# Altium schematic sheet XT short bus with break-away tab ( 5.2 X 4.2 inches).schdoc: XT short bus with break-away tab ( 5.2 X 4.2 inches)
size A2; Organization: Organization; Address1: Address1; Address2: Address2; Address3: Address3; Address4: Address4; DocumentNumber: 1; Revision: 0; SheetNumber: 2; SheetTotal: 2
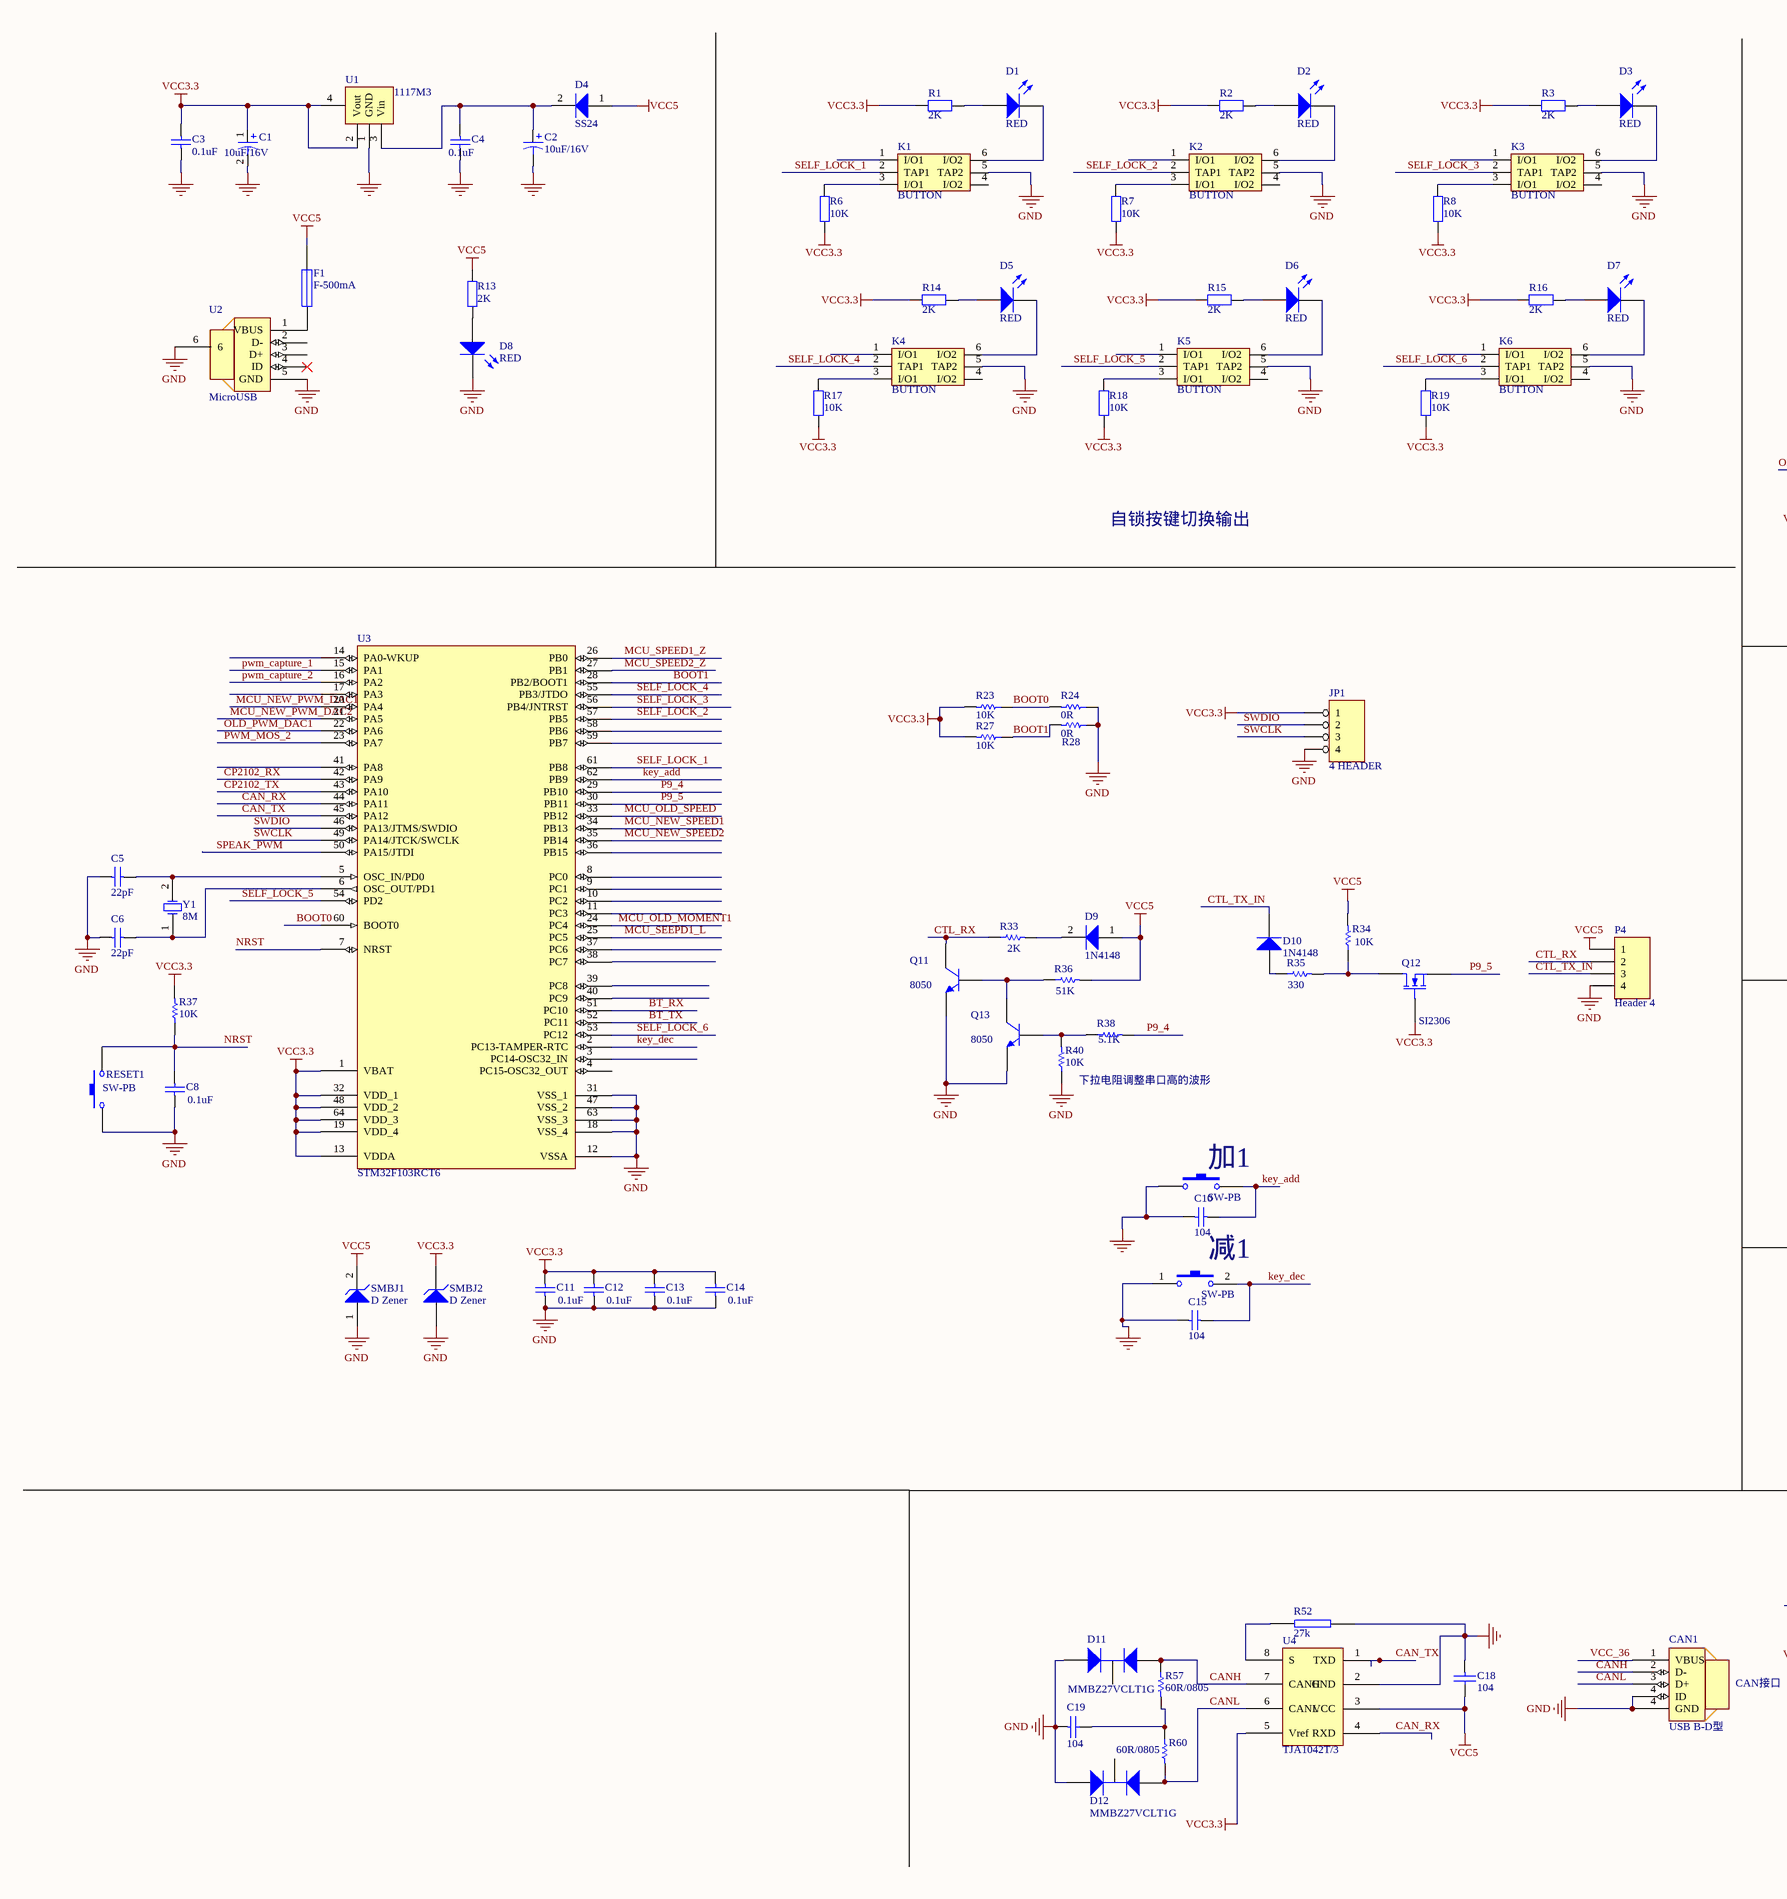
[diagram p0: XT short bus with break-away tab ( 5.2 X 4.2 inches).schdoc, left]
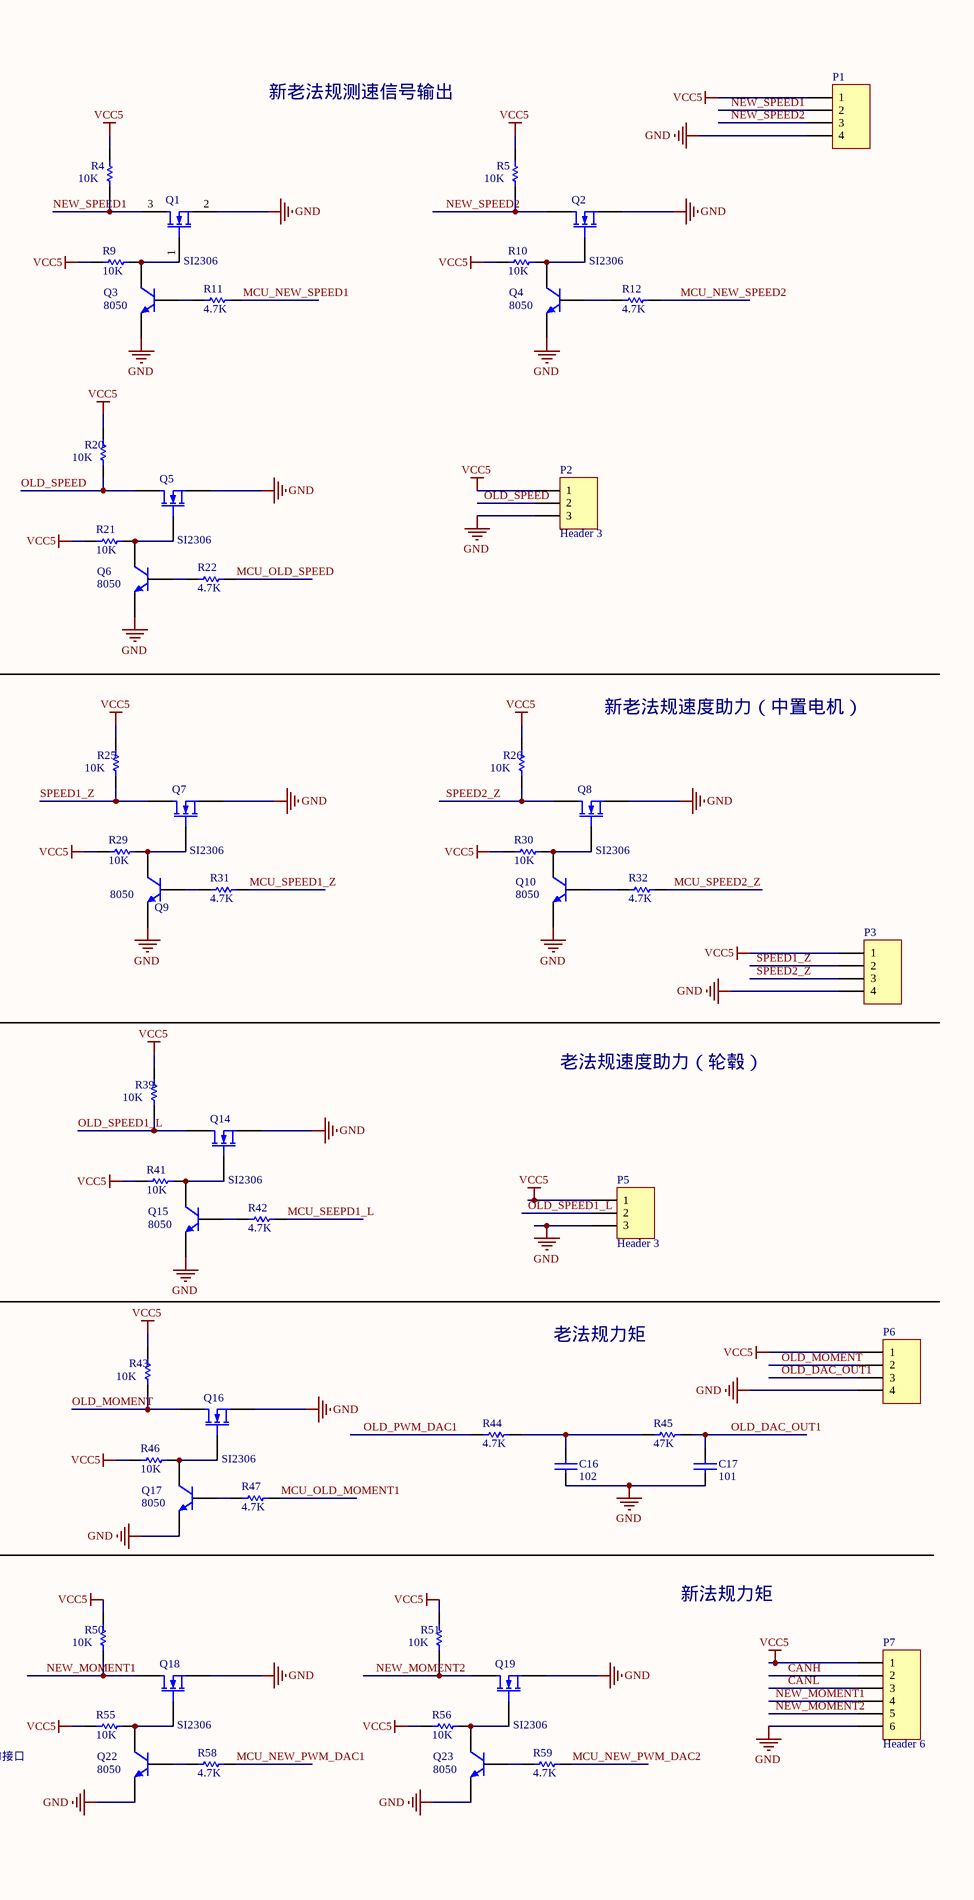
[diagram p1: XT short bus with break-away tab ( 5.2 X 4.2 inches).schdoc, right]

## Parts
C1  10uF/16V  [1206]
C2  10uF/16V  [1206]
C3  0.1uF  [LC-0603_C]
C4  0.1uF  [LC-0603_C]
C5  22pF  [LC-0603_C]
C6  22pF  [LC-0603_C]
C8  0.1uF  [LC-0603_C]
C10  104  [LC-0603_C]
C11  0.1uF  [LC-0603_C]
C12  0.1uF  [LC-0603_C]
C13  0.1uF  [LC-0603_C]
C14  0.1uF  [LC-0603_C]
C15  104  [LC-0603_C]
C16  102  [LC-0603_C]
C17  101  [LC-0603_C]
C18  104  [LC-0603_C]
C19  104  [LC-0603_C]
CAN1  USB B-D型  [USB B-D型_2]
D1  RED  [LED_A2]
D2  RED  [LED_A2]
D3  RED  [LED_A2]
D4  SS24  [LC-SMA(DO-214AC)_S1]
D5  RED  [LED_A2]
D6  RED  [LED_A2]
D7  RED  [LED_A2]
D8  RED  [LED_A2]
D9  1N4148  [DIODE_SOP]
D10  1N4148  [DIODE_SOP]
D11  MMBZ27VCLT1G  [SOT-23]
D12  MMBZ27VCLT1G  [sot-23]
F1  F-500mA  [1206A]
JP1  4 HEADER  [HDR1X4]
K1  BUTTON  [BTN8.5*8.5]
K2  BUTTON  [BTN8.5*8.5]
K3  BUTTON  [BTN8.5*8.5]
K4  BUTTON  [BTN8.5*8.5]
K5  BUTTON  [BTN8.5*8.5]
K6  BUTTON  [BTN8.5*8.5]
P1  Header 4  [HDR1X4]  (value not drawn)
P2  Header 3  [HDR1X3]
P3  Header 4  [HDR1X4]  (value not drawn)
P4  Header 4  [HDR1X4]
P5  Header 3  [HDR1X3]
P6  Header 4  [HDR1X4]  (value not drawn)
P7  Header 6  [HDR1X6]
Q1  SI2306  [sot-23]
Q2  SI2306  [sot-23]
Q3  8050  [sot-23]
Q4  8050  [sot-23]
Q5  SI2306  [sot-23]
Q6  8050  [sot-23]
Q7  SI2306  [sot-23]
Q8  SI2306  [sot-23]
Q9  8050  [sot-23]
Q10  8050  [sot-23]
Q11  8050  [sot-23]
Q12  SI2306  [sot-23]
Q13  8050  [sot-23]
Q14  SI2306  [sot-23]
Q15  8050  [sot-23]
Q16  SI2306  [sot-23]
Q17  8050  [sot-23]
Q18  SI2306  [sot-23]
Q19  SI2306  [sot-23]
Q22  8050  [sot-23]
Q23  8050  [sot-23]
R1  2K  [LC-0603_R]
R2  2K  [LC-0603_R]
R3  2K  [LC-0603_R]
R4  10K  [LC-0603_R]
R5  10K  [LC-0603_R]
R6  10K  [LC-0603_R]
R7  10K  [LC-0603_R]
R8  10K  [LC-0603_R]
R9  10K  [LC-0603_R]
R10  10K  [LC-0603_R]
R11  4.7K  [LC-0603_R]
R12  4.7K  [LC-0603_R]
R13  2K  [LC-0603_R]
R14  2K  [LC-0603_R]
R15  2K  [LC-0603_R]
R16  2K  [LC-0603_R]
R17  10K  [LC-0603_R]
R18  10K  [LC-0603_R]
R19  10K  [LC-0603_R]
R20  10K  [LC-0603_R]
R21  10K  [LC-0603_R]
R22  4.7K  [LC-0603_R]
R23  10K  [LC-0603_R]
R24  0R  [LC-0603_R]
R25  10K  [LC-0603_R]
R26  10K  [LC-0603_R]
R27  10K  [LC-0603_R]
R28  0R  [LC-0603_R]
R29  10K  [LC-0603_R]
R30  10K  [LC-0603_R]
R31  4.7K  [LC-0603_R]
R32  4.7K  [LC-0603_R]
R33  2K  [LC-0603_R]
R34  10K  [LC-0603_R]
R35  330  [LC-0603_R]
R36  51K  [LC-0603_R]
R37  10K  [LC-0603_R]
R38  5.1K  [LC-0603_R]
R39  10K  [LC-0603_R]
R40  10K  [LC-0603_R]
R41  10K  [LC-0603_R]
R42  4.7K  [LC-0603_R]
R43  10K  [LC-0603_R]
R44  4.7K  [LC-0603_R]
R45  47K  [LC-0603_R]
R46  10K  [LC-0603_R]
R47  4.7K  [LC-0603_R]
R50  10K  [LC-0603_R]
R51  10K  [LC-0603_R]
R52  27k  [LC-0603_R]
R55  10K  [LC-0603_R]
R56  10K  [LC-0603_R]
R57  60R/0805  [LC-0603_R]
R58  4.7K  [LC-0603_R]
R59  4.7K  [LC-0603_R]
R60  60R/0805  [LC-0603_R]
RESET1  SW-PB  [按键-贴片-6X6]
SMBJ1  D Zener  [LC-SMB(DO-214AA)_S1]
SMBJ2  D Zener  [LC-SMB(DO-214AA)_S1]
U1  1117M3  [SOT-223]
U2  MicroUSB  [USB1_mini_直插]
U3  STM32F103RCT6  [LC-LQFP-64_10X10X05P]
U4  TJA1042T/3  [LC-SOP-8_150mil]
Y1  8M  [XTAL_US]
减1  SW-PB  [按键-贴片-6X6]
加1  SW-PB  [按键-贴片-6X6]

## Nets
GND: C1.2 C2.2 C3.2 C4.2 C5.1 C6.1 C8.1 C10.1 C11.1 C12.1 C13.1 C14.1 C15.1 C16.1 C17.1 C18.1 C19.1 CAN1.4(ID) D8.2(K) D11.1(A) D12.2(C) JP1.4 K1.5(TAP2) K2.5(TAP2) K3.5(TAP2) K4.5(TAP2) K5.5(TAP2) K6.5(TAP2) P1.4 P2.3 P3.4 P4.4 P5.3 P6.4 P7.6 Q1.2(S) Q2.2(S) Q3.2(E) Q4.2(E) Q5.2(S) Q6.2(E) Q7.2(S) Q8.2(S) Q9.2(E) Q10.2(E) Q11.2(E) Q13.2(E) Q14.2(S) Q15.2(E) Q16.2(S) Q17.2(E) Q18.2(S) Q19.2(S) Q22.2(E) Q23.2(E) R24.1 R28.1 R40.1 R52.1 RESET1.1 SMBJ1.1(A) SMBJ2.1(A) U1.1(GND) U2.5(GND) U2.6 U3.12(VSSA) U3.18(VSS_4) U3.31(VSS_1) U3.47(VSS_2) U3.63(VSS_3) U4.2(GND) 减1.1 加1.1
VCC3.3: C1.1 C3.1 C11.2 C12.2 C13.2 C14.2 JP1.1 Q12.1(G) R1.2 R2.2 R3.2 R6.2 R7.2 R8.2 R14.2 R15.2 R16.2 R17.2 R18.2 R19.2 R23.2 R27.2 R37.2 SMBJ2.2(K) U1.2(Vout) U1.4(Vout) U3.1(VBAT) U3.13(VDDA) U3.19(VDD_4) U3.32(VDD_1) U3.48(VDD_2) U3.64(VDD_3) U4.5(Vref)
VCC5: C18.2 D4.1(A) D9.1(A) F1.2 P1.1 P2.1 P3.1 P4.1 P5.1 P6.1 P7.1 R4.2 R5.2 R9.2 R10.2 R13.1 R20.2 R21.2 R25.2 R26.2 R29.2 R30.2 R34.2 R36.2 R39.2 R41.2 R43.2 R46.2 R50.2 R51.2 R55.2 R56.2 SMBJ1.2(K) U4.3(VCC)
BOOT0: R23.1 R24.2 U3.60(BOOT0)
BOOT1: R27.1 R28.2 U3.28(PB2/BOOT1)
BT_RX: U3.51(PC10)
BT_TX: U3.52(PC11)
CAN_RX: U3.44(PA11) U4.4(RXD)
CAN_TX: U3.45(PA12) U4.1(TXD)
CANH: CAN1.2(D-) D11.2(C) P7.2 R57.1 U4.7(CANH)
CANL: CAN1.3(D+) D12.1(A) P7.3 R60.2 U4.6(CANL)
CP2102_RX: U3.42(PA9)
CP2102_TX: U3.43(PA10)
CTL_RX: P4.2 Q11.3(C) R33.1
CTL_TX_IN: D10.2(K) P4.3
key_add: C10.2 U3.62(PB9) 加1.2
key_dec: C15.2 U3.2(PC13-TAMPER-RTC) 减1.2
MCU_NEW_PWM_DAC1: R58.1 U3.20(PA4)
MCU_NEW_PWM_DAC2: R59.1 U3.21(PA5)
MCU_NEW_SPEED1: R11.1 U3.34(PB13)
MCU_NEW_SPEED2: R12.1 U3.35(PB14)
MCU_OLD_MOMENT1: R47.1 U3.24(PC4)
MCU_OLD_SPEED: R22.1 U3.33(PB12)
MCU_SEEPD1_L: R42.1 U3.25(PC5)
MCU_SPEED1_Z: R31.1 U3.26(PB0)
MCU_SPEED2_Z: R32.1 U3.27(PB1)
NEW_MOMENT1: P7.4 Q18.3(D) R50.1
NEW_MOMENT2: P7.5 Q19.3(D) R51.1
NEW_SPEED1: P1.2 Q1.3(D) R4.1
NEW_SPEED2: P1.3 Q2.3(D) R5.1
NRST: C8.2 R37.1 RESET1.2 U3.7(NRST)
OLD_DAC_OUT1: C17.2 P6.3 R45.1
OLD_MOMENT: P6.2 Q16.3(D) R43.1
OLD_PWM_DAC1: R44.2 U3.22(PA6)
OLD_SPEED: P2.2 Q5.3(D) R20.1
OLD_SPEED1_L: P5.2 Q14.3(D) R39.1
P9_4: R38.2 U3.29(PB10)
P9_5: Q12.2(S) U3.30(PB11)
pwm_capture_1: U3.15(PA1)
pwm_capture_2: U3.16(PA2)
PWM_MOS_2: U3.23(PA7)
SELF_LOCK_1: K1.2(TAP1) U3.61(PB8)
SELF_LOCK_2: K2.2(TAP1) U3.57(PB5)
SELF_LOCK_3: K3.2(TAP1) U3.56(PB4/JNTRST)
SELF_LOCK_4: K4.2(TAP1) U3.55(PB3/JTDO)
SELF_LOCK_5: K5.2(TAP1) U3.54(PD2)
SELF_LOCK_6: K6.2(TAP1) U3.53(PC12)
SPEAK_PWM: U3.50(PA15/JTDI)
SPEED1_Z: P3.2 Q7.3(D) R25.1
SPEED2_Z: P3.3 Q8.3(D) R26.1
SWCLK: JP1.3 U3.49(PA14/JTCK/SWCLK)
SWDIO: JP1.2 U3.46(PA13/JTMS/SWDIO)
VCC_36: CAN1.1(VBUS)
NetC2_1: C2.1 C4.1 D4.2(K) U1.3(Vin)
NetC5_2: C5.2 U3.5(OSC_IN/PD0) Y1.2(OSC2)
NetC6_2: C6.2 U3.6(OSC_OUT/PD1) Y1.1(OSC1)
NetC16_2: C16.2 R44.1 R45.2
NetC19_2: C19.2 R57.2 R60.1
NetD1_1: D1.1(A) R1.1
NetD1_2: D1.2(K) K1.6(I/O2)
NetD2_1: D2.1(A) R2.1
NetD2_2: D2.2(K) K2.6(I/O2)
NetD3_1: D3.1(A) R3.1
NetD3_2: D3.2(K) K3.6(I/O2)
NetD5_1: D5.1(A) R14.1
NetD5_2: D5.2(K) K4.6(I/O2)
NetD6_1: D6.1(A) R15.1
NetD6_2: D6.2(K) K5.6(I/O2)
NetD7_1: D7.1(A) R16.1
NetD7_2: D7.2(K) K6.6(I/O2)
NetD8_1: D8.1(A) R13.2
NetD9_2: D9.2(K) R33.2
NetD10_1: D10.1(A) R35.1
NetF1_1: F1.1 U2.1(VBUS)
NetK1_3: K1.3(I/O1) R6.1
NetK2_3: K2.3(I/O1) R7.1
NetK3_3: K3.3(I/O1) R8.1
NetK4_3: K4.3(I/O1) R17.1
NetK5_3: K5.3(I/O1) R18.1
NetK6_3: K6.3(I/O1) R19.1
NetQ1_1: Q1.1(G) Q3.3(C) R9.1
NetQ2_1: Q2.1(G) Q4.3(C) R10.1
NetQ3_1: Q3.1(B) R11.2
NetQ4_1: Q4.1(B) R12.2
NetQ5_1: Q5.1(G) Q6.3(C) R21.1
NetQ6_1: Q6.1(B) R22.2
NetQ7_1: Q7.1(G) Q9.3(C) R29.1
NetQ8_1: Q8.1(G) Q10.3(C) R30.1
NetQ9_1: Q9.1(B) R31.2
NetQ10_1: Q10.1(B) R32.2
NetQ11_1: Q11.1(B) Q13.3(C) R36.1
NetQ12_3: Q12.3(D) R34.1 R35.2
NetQ13_1: Q13.1(B) R38.1 R40.2
NetQ14_1: Q14.1(G) Q15.3(C) R41.1
NetQ15_1: Q15.1(B) R42.2
NetQ16_1: Q16.1(G) Q17.3(C) R46.1
NetQ17_1: Q17.1(B) R47.2
NetQ18_1: Q18.1(G) Q22.3(C) R55.1
NetQ19_1: Q19.1(G) Q23.3(C) R56.1
NetQ22_1: Q22.1(B) R58.2
NetQ23_1: Q23.1(B) R59.2
NetR52_2: R52.2 U4.8(S)

Not connected (* = marked no-connect by the designer): D11 3(N); D12 3(N); K1 1(I/O1) 4(I/O2); K2 1(I/O1) 4(I/O2); K3 1(I/O1) 4(I/O2); K4 1(I/O1) 4(I/O2); K5 1(I/O1) 4(I/O2); K6 1(I/O1) 4(I/O2); U2 2(D-) 3(D+) 4(ID)*; U3 3(PC14-OSC32_IN) 4(PC15-OSC32_OUT) 8(PC0) 9(PC1) 10(PC2) 11(PC3) 14(PA0-WKUP) 17(PA3) 36(PB15) 37(PC6) 38(PC7) 39(PC8) 40(PC9) 41(PA8) 58(PB6) 59(PB7)

## Notes on the sheet
- 新老法规测速信号输出
- 自锁按键切换输出
- 新老法规速度助力（中置电机）
- 老法规速度助力（轮毂）
- (near R40) 下拉电阻调整串口高的波形
- 老法规力矩
- 新法规力矩
- CAN接口

## Library data of the parts
C1 C2 = Cap Pol1: Polarized Capacitor (Radial); Value: 100pF; Published: 8-Jun-2000; LatestRevisionDate: 17-Jul-2002; LatestRevisionNote: Re-released for DXP Platform.; PackageReference: RB7.6-15; Publisher: Altium Limited
C3-C6 C8 C10-C15 = Cap: Capacitor; Published: 8-Jun-2000; LatestRevisionDate: 17-Jul-2002; LatestRevisionNote: Re-released for DXP Platform.; PackageReference: RAD-0.3; Publisher: Altium Limited
  C3 C4 C8 C11-C14: Value: 0.1uF
  C5 C6: Value: 22pF
  C10 C15: PackageDescription: Radial Cap, Thru-Hole; 2 Leads; 0.3 in Pin Spacing; Value: 104
C16-C19 = CAP: Capacitor
CAN1 U2 = MINIUSB
D1-D3 D5-D8 = LED0: Typical INFRARED GaAs LED; Published: 8-Jun-2000; LatestRevisionDate: 08-Jul-2005; LatestRevisionNote: Mech Layer 1 removed.; PackageReference: LED-0; Publisher: Altium Limited; PackageDescription: LED; 2 Leads
D4 D9 D10 = Diode 1N4007: 1 Amp General Purpose Rectifier; Published: 8-Jun-2000; LatestRevisionDate: 17-Jul-2002; LatestRevisionNote: Re-released for DXP Platform.; DatasheetVersion: 1998; PackageVersion: Aug-1999; PackageReference: DO-41; Publisher: Altium Limited; PackageDescription: Diode, Axial; Body 5.2 x 2.7 mm (LxDia. max), Lead Dia. 0.86 mm (max); Code_JEDEC: DO-204-AL; ComponentLink1Description: Manufacturer Link; ComponentLink1URL: http://www.fairchildsemi.com/; ComponentLink2Description: Datasheet; ComponentLink2URL: http://www.fairchildsemi.com/ds/1N%2F1N4001.pdf
D11 D12 = BAT54C: TVS二极管,  MMBZ27VCLT1G, 27V, 两个共阴极, SOT-23
F1 = FUSE1
JP1 = 4 HEADER: 4 Pin Header
P1 P3 P4 P6 = Header 4: Header, 4-Pin; LatestRevisionDate: 17-Jul-2002; LatestRevisionNote: Re-released for DXP Platform.; Publisher: Altium Limited
P2 P5 = Header 3: Header, 3-Pin; LatestRevisionDate: 17-Jul-2002; LatestRevisionNote: Re-released for DXP Platform.; Publisher: Altium Limited
P7 = Header 6: Header, 6-Pin; LatestRevisionDate: 17-Jul-2002; LatestRevisionNote: Re-released for DXP Platform.; Publisher: Altium Limited
Q1 Q2 Q5 Q7 Q8 Q12 Q14 Q16 Q18 Q19 = MOSFET-N: N-Channel MOSFET; PackageDocument: 1995/1996; Published: 8-Jun-2000; LatestRevisionDate: 17-Jul-2002; LatestRevisionNote: Re-released for DXP Platform.; PackageReference: E3; Publisher: Altium Limited
Q3 Q4 Q6 Q9-Q11 Q13 Q15 Q17 Q22 Q23 = 2N3904: NPN General Purpose Amplifier; Published: 8-Jun-2000; LatestRevisionDate: 15-Jan-2003; LatestRevisionNote: PCB Footprint 'BCY-W3/D4.7' replaced; DatasheetDocument: 1997; PackageDocument: Sep-1998; PackageReference: TO-92A; Publisher: Altium Limited; Code_JEDEC: TO-92A; ComponentLink1Description: Manufacturer Link; ComponentLink1URL: http://www.fairchildsemi.com/; ComponentLink2Description: Datasheet; ComponentLink2URL: http://www.fairchildsemi.com/ds/2N%2F2N3904.pdf
R1-R3 R6-R8 R13-R19 = Res2: Resistor; Published: 8-Jun-2000; LatestRevisionDate: 17-Jul-2002; LatestRevisionNote: Re-released for DXP Platform.; PackageReference: AXIAL-0.4; Publisher: Altium Limited; PackageDescription: Axial Device, Thru-Hole; 2 Leads; 0.4 in Pin Spacing
  R1-R3 R13-R16: Value: 2K
  R6-R8 R17-R19: Value: 10K
R4 R5 R9-R12 R20-R47 R50 R51 R55-R60 = Res1: Resistor; Published: 8-Jun-2000; LatestRevisionDate: 17-Jul-2002; LatestRevisionNote: Re-released for DXP Platform.; PackageReference: AXIAL-0.3; Publisher: Altium Limited; PackageDescription: Axial Device, Thru-Hole; 2 Leads; 0.3 in Pin Spacing
  R4 R5 R9 R10 R20 R21 R23 R25-R27 R29 R30 R34 R37 R39-R41 R43 R46 R50 R51 R55 R56: Value: 10K
  R11 R12 R22 R31 R32 R42 R44 R47 R58 R59: Value: 4.7K
  R24 R28: Value: 0R
  R33: Value: 2K
  R35: Value: 330
  R36: Value: 51K
  R38: Value: 5.1K
  R45: Value: 47K
  R57 R60: Value: 60R/0805
R52 = RES2
RESET1 减1 加1 = SW-PB: Switch; LatestRevisionDate: 17-Jul-2002; LatestRevisionNote: Re-released for DXP Platform.; PackageReference: SPST-2; Publisher: Altium Limited; PackageDescription: Switch; 2 Leads
  RESET1 加1: Published: 24-Mar-1999
  减1: Published: https://item.taobao.com/item.htm?spm=a230r.1.14.147.cuRCly&id=531872530134&ns=1&abbucket=13#detail
SMBJ1 SMBJ2 = D Zener: Zener Diode; Published: 8-Jun-2000; LatestRevisionDate: 17-Jul-2002; LatestRevisionNote: Re-released for DXP Platform.; PackageReference: DIODE-0.7; Publisher: Altium Limited; PackageDescription: Diode, Thru-Hole; 2 Leads; 0.7 in Pin Spacing
U3 = STM32F103RBT6: STM32 ARM-based 32-bit MCU with 128 Kbytes Flash, 64-pin LQFP, Industrial Temperature; Published: 30-May-2008; DatasheetVersion: rev6, Mar-2008; PackageVersion: Mar-2008; PackageReference: LQFP64; Publisher: Altium Limited; PackageDescription: 64-Pin Low-Profile Quad Flat Pack, 10 x 10 mm Body, 0.5 mm Pitch (LQFP64); ComponentLink1Description: Manufacturer Link; ComponentLink1URL: www.st.com/stm32; ComponentLink2Description: Datasheet; ComponentLink2URL: http://www.st.com/stonline/products/literature/ds/13587.pdf
U4 = TJA1050
Y1 = XTAL: Crystal Oscillator; Published: 8-Jun-2000; LatestRevisionDate: 17-Jul-2002; LatestRevisionNote: Re-released for DXP Platform.; PackageReference: R38; Publisher: Altium Limited